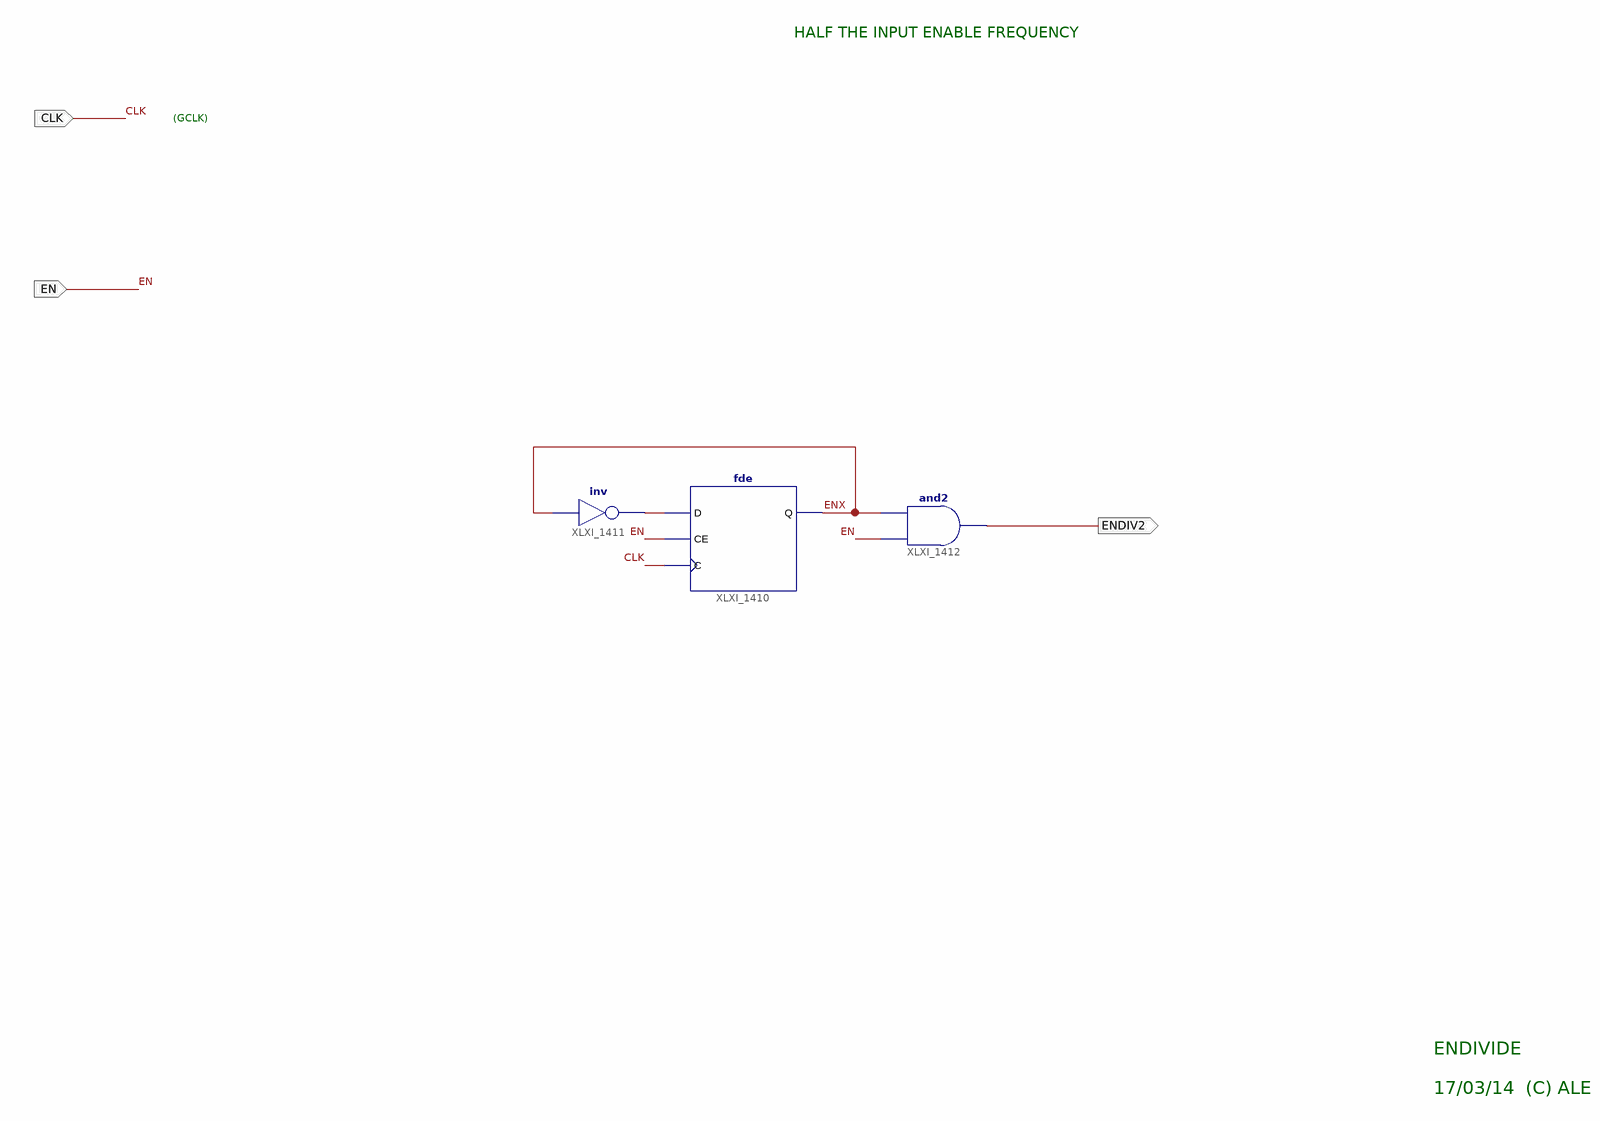
[diagram p0: schematic sheet 1]
// Xilinx ISE schematic EnDivide.sch (spartan3e) as structural Verilog: 3 symbols, 3 ports
module EnDivide (
  input  CLK,
  input  EN,
  output ENDIV2
);

  wire ENX, XLXN_46;

  fde XLXI_1410 (.C(CLK), .CE(EN), .D(XLXN_46), .Q(ENX));
  not XLXI_1411 (XLXN_46, ENX);
  and XLXI_1412 (ENDIV2, EN, ENX);

  // Notes on the sheet:
  //   HALF THE INPUT ENABLE FREQUENCY
  //   (GCLK)
  //   ENDIVIDE
  //   17/03/14  (C) ALE
endmodule
